# EAGLE design Quarantatre (EAGLE 7.1.0)
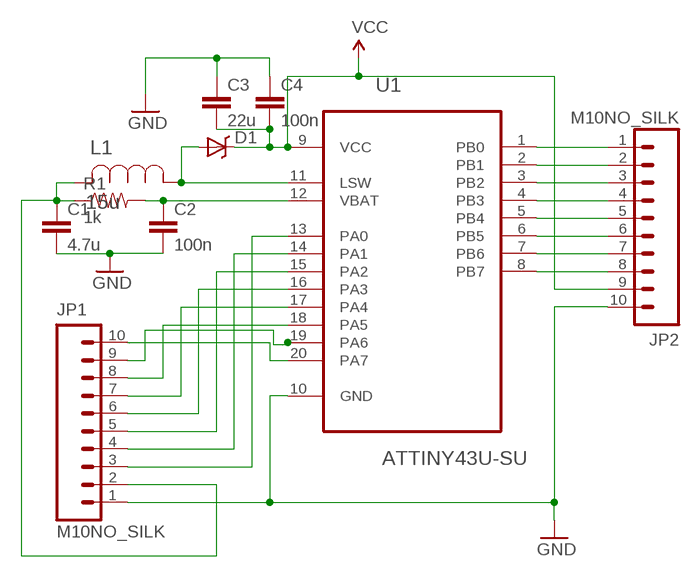
[diagram p0: schematic, sheet 1]

## Parts
C1  4.7u  C-EUC0805  [C0805]
C2  100n  CAP0603-CAP  [0603-CAP]
C3  22u  C-EUC0805  [C0805]
C4  100n  CAP0603-CAP  [0603-CAP]
D1  BAT20JFILM  [SOD-323]
JP1  M10NO_SILK  [1X10_NO_SILK]
JP2  M10NO_SILK  [1X10_NO_SILK]
L1  15u  NRS4012T150MDGJ  [IND4040]
R1  1k  RESISTOR0603-RES  [0603-RES]
U1  ATTINY43U-SU  [SOIC127P1032X265-20N]

## Nets
GND: C1.2 C2.2 C3.1 C4.1 JP1.1 JP2.10 U1.10(GND)
N$1: C1.1 JP1.2 L1.P$2 R1.1
N$2: C2.1 R1.2 U1.12(VBAT)
N$3: D1.2(A) L1.P$1 U1.11(LSW)
N$4: JP1.9 U1.19(PA6)
N$5: JP1.3 U1.13(PA0)
N$6: JP1.4 U1.14(PA1)
N$7: JP2.1 U1.1(PB0)
N$8: JP2.2 U1.2(PB1)
N$9: JP2.3 U1.3(PB2)
N$10: JP2.4 U1.4(PB3)
N$11: JP2.5 U1.5(PB4)
N$12: JP2.6 U1.6(PB5)
N$13: JP2.7 U1.7(PB6)
N$14: JP2.8 U1.8(PB7)
N$15: JP1.5 U1.15(PA2)
N$16: JP1.6 U1.16(PA3)
N$17: JP1.7 U1.17(PA4)
N$18: JP1.8 U1.18(PA5)
N$20: JP1.10 U1.20(PA7)
VCC: C3.2 C4.2 D1.1(C) JP2.9 U1.9(VCC)

## Library data of the parts
C1 C3 = rcl:C-EU: CAPACITOR, European symbol
C2 C4 = SparkFun-Passives:CAP: Capacitor Standard 0603 ceramic capacitor, and 0.1" leaded capacitor.
D1 = SparkFun-DiscreteSemi:BAT20JFILM: 23V, 1A Schottky diode, SOD-323 package; PROD_ID: DIO-11623
JP1 JP2 = SparkFun-Connectors:M10: Header 10 Standard 10-pin 0.1" header. Use with straight break away headers (SKU : PRT-00116), right angle break away headers (PRT-00553), swiss pins (PRT-00743), machine pins (PRT-00117), and female headers (PRT-00115).
L1 = Microtherion:NRS4012T150MDGJ
R1 = SparkFun-Passives:RESISTOR: Resistor Basic schematic elements and footprints for 0603, 1206, and PTH resistors.
U1 = Atmel_By_element14_Batch_1-00:ATTINY43U-SU: 8-bit Microcontroller with In-System Programmable Flash and Boost Converter; MPN: ATTINY43U-SU; OC_FARNELL: 1841623; OC_NEWARK: 12T1338; PACKAGE: SOIC-20; SUPPLIER: Atmel

## Board
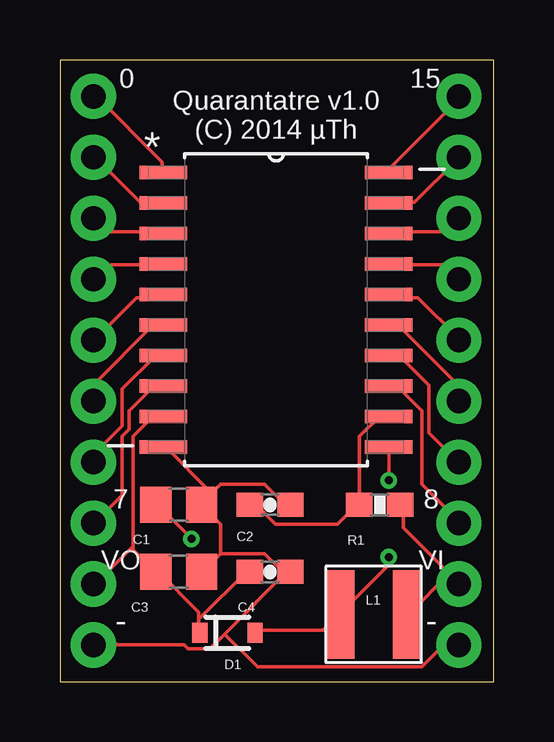
[diagram p1: board, top side]
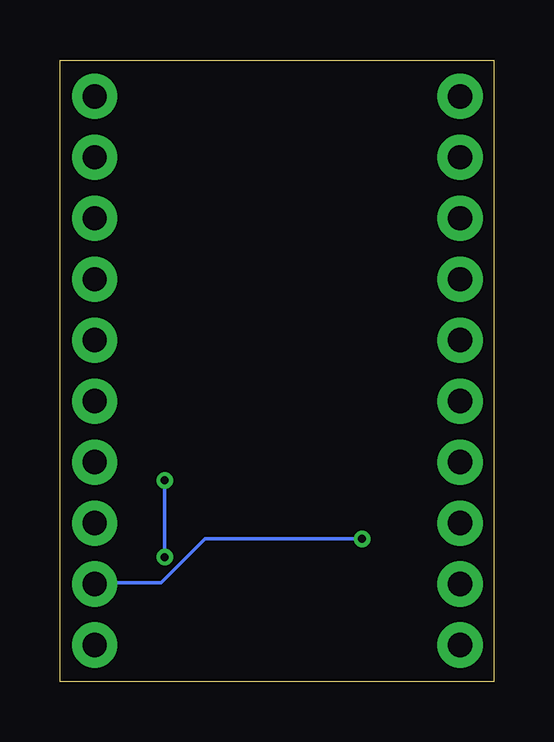
[diagram p2: board, bottom side, seen from below]

Size 18.09 x 25.9 mm. Coordinates in mm from the lower left corner, seen from the top.
Outline: 0,0 18.09,0 18.09,25.9 0,25.9 0,0
Copper layers (1*16): Top 0.0356mm / dielectric 1.5011mm / Bottom 0.0356mm
Design rules "OSHPark": minimum track width 6mil, minimum drill 13mil, track to track 6mil, track to pad 6mil, pad to pad 6mil, via to via 6mil, smd to smd 6mil, copper to edge 15mil, drill to drill 6mil, minimum pad ring 7mil, minimum via ring 7mil, stop-mask expansion 3mil, vias tented up to drill 0mil, thermal gap 10mil

### Footprints (pad centres in the part's own frame; a part is rotated, then mirrored left to right if it is on the bottom)
C0805 = smd 1.3 x 1.5: 1 -0.95,0; 2 0.95,0
0603-CAP = smd 1.1 x 1: 1 -0.85,0; 2 0.85,0
SOD-323 = smd 0.63 x 0.83: 1 -1.15,0; 2 1.15,0
1X10_NO_SILK = drill 1.016 pad 1.88: 1 0,0; 2 2.54,0; 3 5.08,0; 4 7.62,0; 5 10.16,0; 6 12.7,0; 7 15.24,0; 8 17.78,0; 9 20.32,0; 10 22.86,0
IND4040 = smd 1.2 x 3.7: P$1 -1.4,0; P$2 1.4,0
0603-RES = smd 1.1 x 1: 1 -0.85,0; 2 0.85,0
SOIC127P1032X265-20N = smd 1.981 x 0.559: 1 -4.699,5.715; 2 -4.699,4.445; 3 -4.699,3.175; 4 -4.699,1.905; 5 -4.699,0.635; 6 -4.699,-0.635; 7 -4.699,-1.905; 8 -4.699,-3.175; 9 -4.699,-4.445; 10 -4.699,-5.715; 11 4.699,-5.715; 12 4.699,-4.445; 13 4.699,-3.175; 14 4.699,-1.905; 15 4.699,-0.635; 16 4.699,0.635; 17 4.699,1.905; 18 4.699,3.175; 19 4.699,4.445; 20 4.699,5.715

### Placement (x,y rotation side)
C1  4.95,7.37 0 top
C2  8.76,7.37 0 top
C3  4.95,4.57 180 top
C4  8.76,4.57 180 top
D1  6.99,2.03 0 top
JP1  16.64,1.52 90 top
JP2  1.4,24.38 270 top
L1  13.08,2.79 0 top
R1  13.34,7.37 180 top
U1  9.02,15.49 0 top

### Tracks (layer width: path | path; a pad name or v marks a point on that pad's centre or on a via)
GND
  Top 0.152: 9.45,4.57 9.3,4.57 8.53,5.33 6.71,5.33 | 9.45,4.57 C4.1 | 6.71,5.33 5.94,4.57 C3.1 | 6.4,7.92 5.94,7.47 C1.2 | 6.4,7.92 6.71,8.23 8.53,8.23 9.3,7.47 9.6,7.47 C2.2 | 6.4,7.92 6.25,7.92 4.42,9.75 U1.10 | 6.4,7.92 C1.2 | 6.71,5.33 6.71,6.55 5.94,7.32 C1.2 | JP2.10 5.18,1.52 5.33,1.37 6.25,1.37 6.86,1.98 | 9.45,4.57 6.86,1.98 | JP1.1 16,1.52 15.09,0.61 8.23,0.61 6.86,1.98
N$1  (via drill 0.33)
  Top 0.152: 16.15,4.57 16.61,4.12 JP1.2 16.15,4.57 | 16.15,4.57 14.33,6.4 14.33,7.32 R1.1 | v5.49,5.94 4.12,7.32 C1.1 | 16.15,4.57 16.15,4.42 14.63,2.9 L1.P$2
  Bottom 0.152: v5.49,5.94 12.04,5.94 13.87,4.12 16.61,4.12 JP1.2
N$2
  Top 0.152: C2.1 7.92,7.32 8.23,7.32 8.99,6.55 11.58,6.55 12.34,7.32 R1.2 12.5,7.47 12.5,10.21 13.26,10.97 13.72,10.97 U1.12
N$3  (via drill 0.33)
  Top 0.152: D1.2 8.23,2.13 10.97,2.13 11.58,2.74 L1.P$1 11.73,2.9 13.72,4.88 v13.72,5.18 | v13.72,8.38 U1.11
  Bottom 0.152: v13.72,5.18 v13.72,8.38
N$4
  Top 0.152: U1.19 13.72,19.96 14.78,19.96 16.61,21.79 JP1.9
N$5
  Top 0.152: U1.13 13.72,12.19 14.17,12.19 15.09,11.28 15.09,8.23 16.61,6.71 JP1.3
N$6
  Top 0.152: U1.14 13.72,13.56 14.17,13.56 15.39,12.34 15.39,10.36 16.61,9.14 JP1.4
N$7
  Top 0.152: U1.1 4.27,21.34 4.27,21.64 1.52,24.38 JP2.1
N$8
  Top 0.152: U1.2 4.27,19.96 3.35,19.96 1.52,21.79 JP2.2
N$9
  Top 0.152: U1.3 4.27,18.75 1.98,18.75 1.52,19.2 JP2.3
N$10
  Top 0.152: U1.4 4.27,17.37 2.13,17.37 1.52,16.76 JP2.4
N$11
  Top 0.152: U1.5 4.27,16 3.2,16 1.52,14.33 JP2.5
N$12
  Top 0.152: U1.6 4.27,14.78 3.81,14.78 1.52,12.5 1.52,11.73 JP2.6
N$13
  Top 0.152: U1.7 4.27,13.56 3.96,13.56 2.59,12.19 2.59,10.67 1.52,9.6 1.52,9.14 JP2.7
N$14
  Top 0.152: U1.8 4.27,12.19 3.81,12.19 2.9,11.28 2.9,10.52 2.59,10.21 2.59,7.77 1.52,6.71 JP2.8
N$15
  Top 0.152: U1.15 13.72,14.78 14.17,14.78 16.61,12.34 16.61,11.73 JP1.5
N$16
  Top 0.152: U1.16 13.72,16 14.94,16 16.61,14.33 JP1.6
N$17
  Top 0.152: U1.17 13.72,17.37 16,17.37 16.61,16.76 JP1.7
N$18
  Top 0.152: U1.18 13.72,18.75 16.15,18.75 16.61,19.2 JP1.8
N$20
  Top 0.152: U1.20 13.72,21.34 16.76,24.38 JP1.10
VCC
  Top 0.152: 5.79,2.59 5.79,2.9 4.12,4.57 C3.2 3.96,4.57 3.05,5.49 3.05,5.64 | 5.79,2.59 5.79,2.13 D1.1 | 5.79,2.59 7.77,4.57 C4.2 | 3.05,5.64 3.05,10.21 3.81,10.97 4.27,10.97 U1.9 | 3.05,5.64 1.52,4.12 JP2.9

### Text on the board
tNames: 0 | 15 | Quarantatre v1.0 / (C) 2014 µTh | 7 | 8 | VO | VI | - | -